# Altium schematic sheet Main_3.SchDoc
size 400 x 299 mm; SheetNumber: 6; SheetTotal: 12
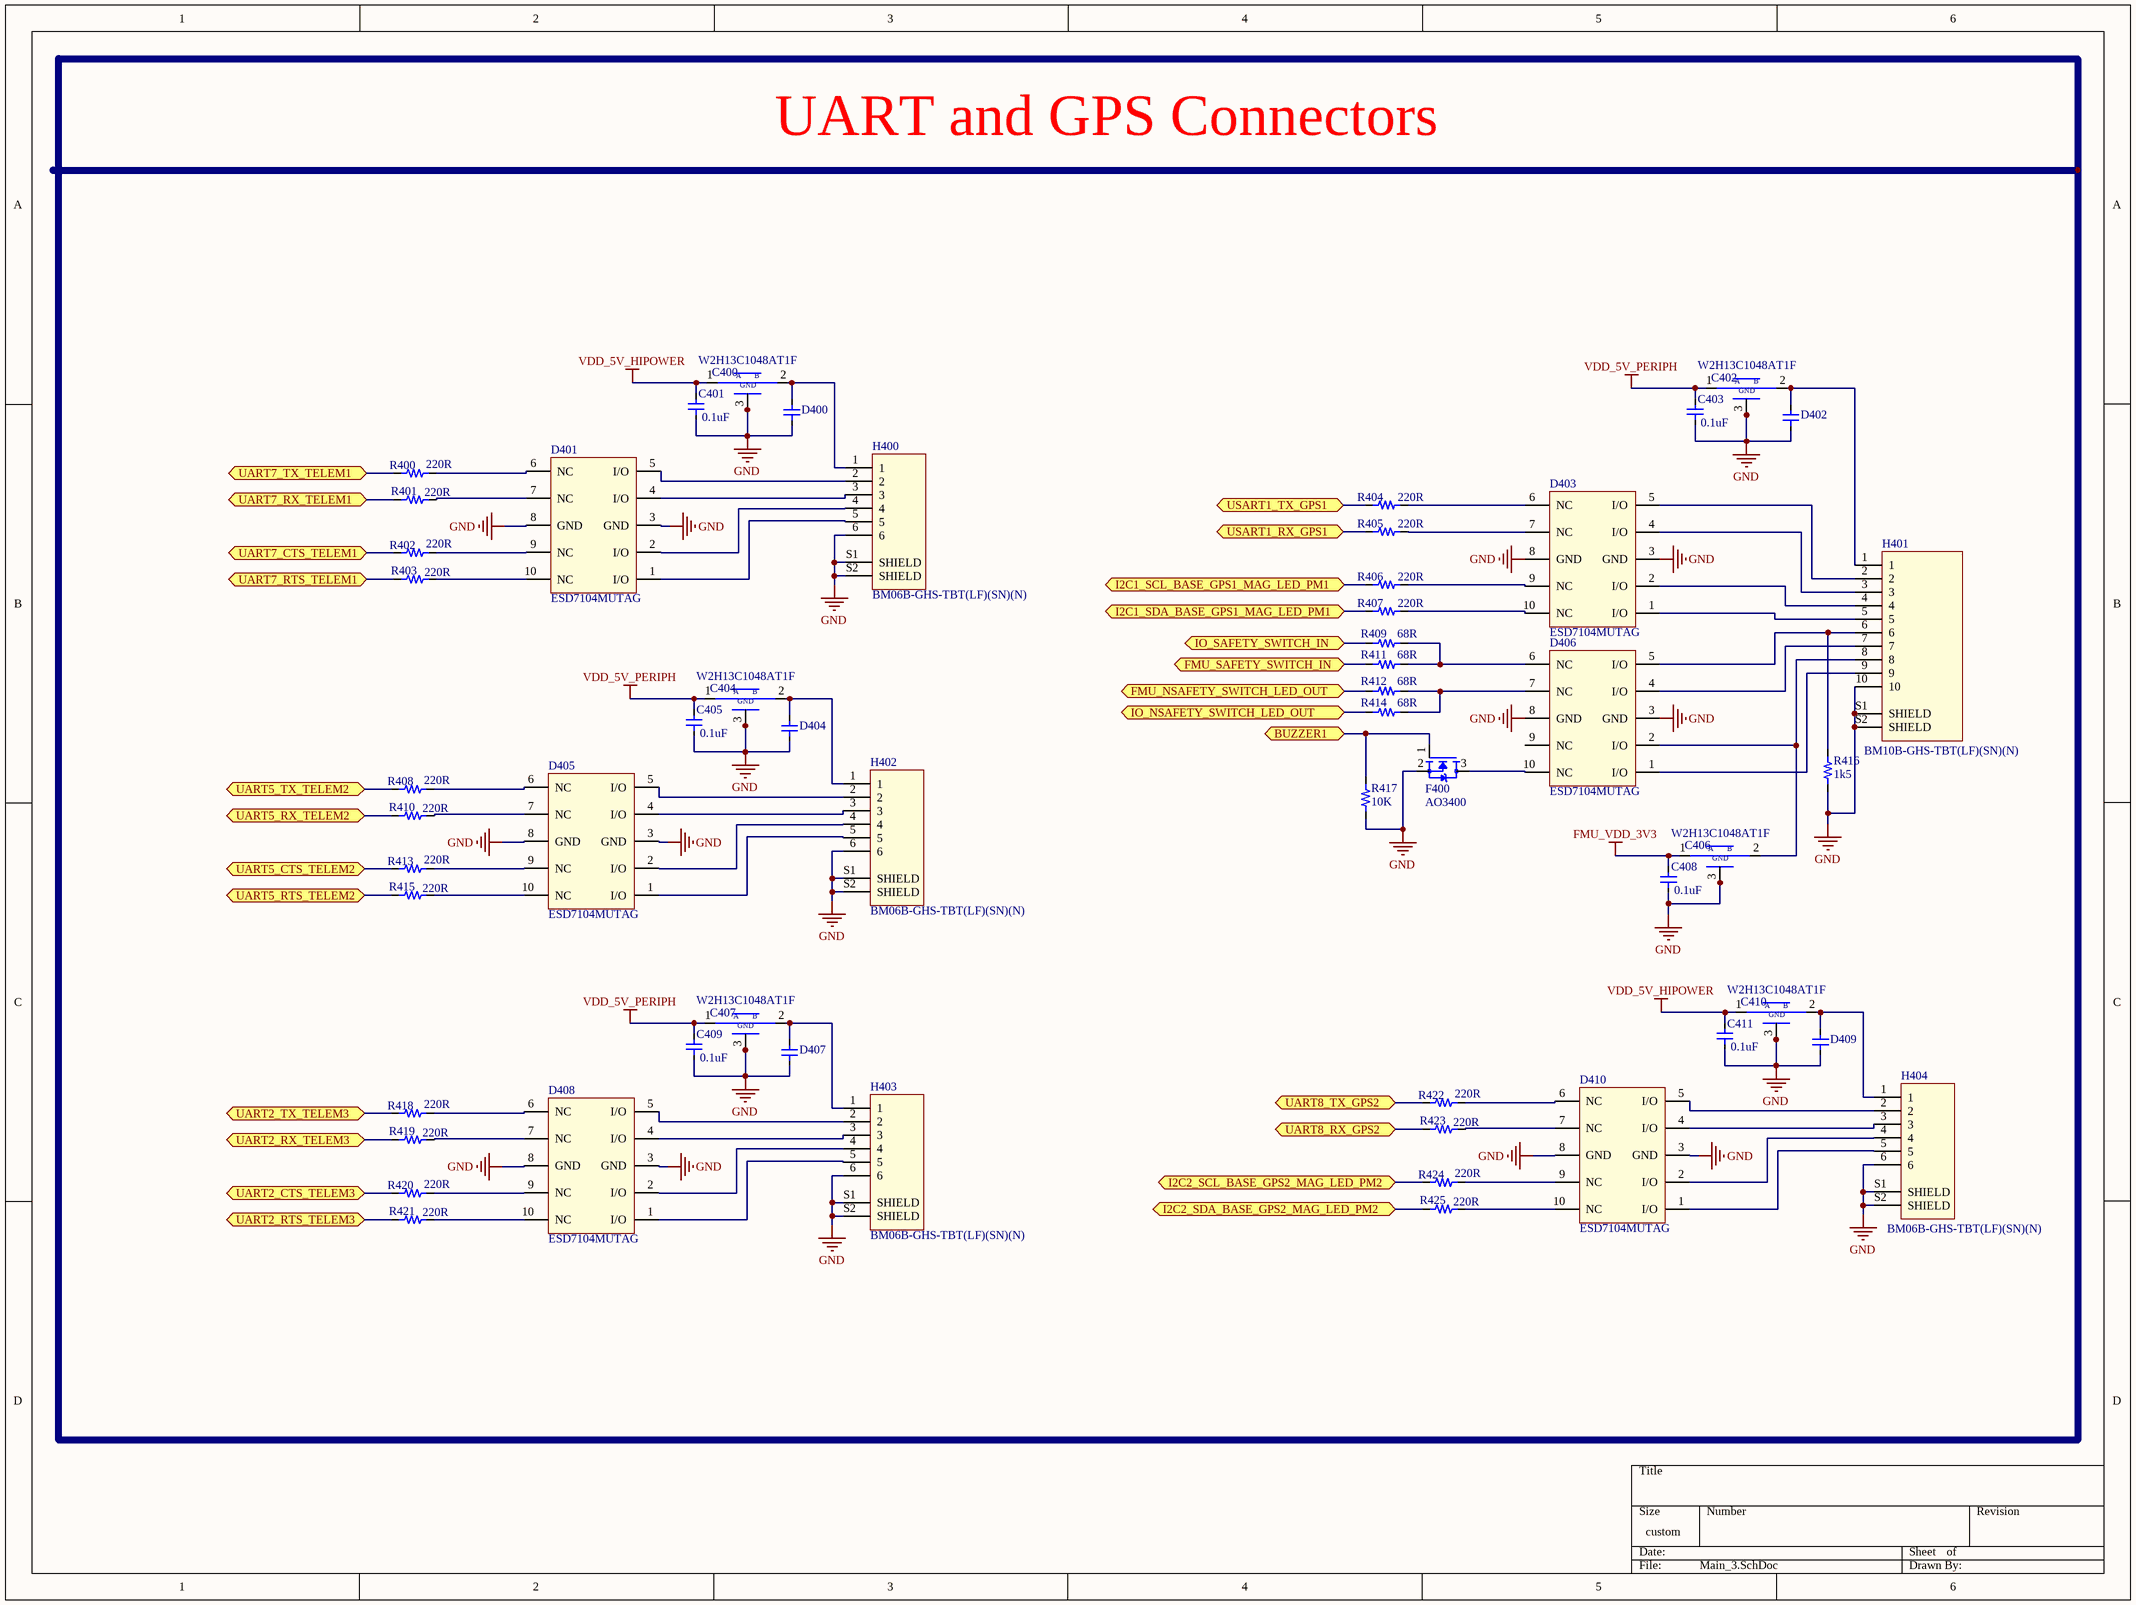
[diagram p0: Main_3.SchDoc]

## Parts
C400  W2H13C1048AT1F  [W2H13C1048AT1F]
C401  0.1uF  [C0603]
C402  W2H13C1048AT1F  [W2H13C1048AT1F]
C403  0.1uF  [C0603]
C404  W2H13C1048AT1F  [W2H13C1048AT1F]
C405  0.1uF  [C0603]
C406  W2H13C1048AT1F  [W2H13C1048AT1F]
C407  W2H13C1048AT1F  [W2H13C1048AT1F]
C408  0.1uF  [C0603]
C409  0.1uF  [C0603]
C410  W2H13C1048AT1F  [W2H13C1048AT1F]
C411  0.1uF  [C0603]
D400  PESD0402-140  [PESD0402-140]  (value not drawn)
D401  ESD7104MUTAG  [UDFN10 2.5x1, 0.5P]
D402  PESD0402-140  [PESD0402-140]  (value not drawn)
D403  ESD7104MUTAG  [UDFN10 2.5x1, 0.5P]
D404  PESD0402-140  [PESD0402-140]  (value not drawn)
D405  ESD7104MUTAG  [UDFN10 2.5x1, 0.5P]
D406  ESD7104MUTAG  [UDFN10 2.5x1, 0.5P]
D407  PESD0402-140  [PESD0402-140]  (value not drawn)
D408  ESD7104MUTAG  [UDFN10 2.5x1, 0.5P]
D409  PESD0402-140  [PESD0402-140]  (value not drawn)
D410  ESD7104MUTAG  [UDFN10 2.5x1, 0.5P]
F400  AO3400  [SOT-23]
H400  BM06B-GHS-TBT(LF)(SN)(N)  [BM06B-GHS-TBT(LF)(SN)(N)]
H401  BM10B-GHS-TBT(LF)(SN)(N)  [BM10B-GHS-TBT(LF)(SN)(N)]
H402  BM06B-GHS-TBT(LF)(SN)(N)  [BM06B-GHS-TBT(LF)(SN)(N)]
H403  BM06B-GHS-TBT(LF)(SN)(N)  [BM06B-GHS-TBT(LF)(SN)(N)]
H404  BM06B-GHS-TBT(LF)(SN)(N)  [BM06B-GHS-TBT(LF)(SN)(N)]
R400  220R  [R0402]
R401  220R  [R0402]
R402  220R  [R0402]
R403  220R  [R0402]
R404  220R  [R0402]
R405  220R  [R0402]
R406  220R  [R0402]
R407  220R  [R0402]
R408  220R  [R0402]
R409  68R  [R0402]
R410  220R  [R0402]
R411  68R  [R0402]
R412  68R  [R0402]
R413  220R  [R0402]
R414  68R  [R0402]
R415  220R  [R0402]
R416  1k5  [R0402]
R417  10K  [R0402]
R418  220R  [R0402]
R419  220R  [R0402]
R420  220R  [R0402]
R421  220R  [R0402]
R422  220R  [R0402]
R423  220R  [R0402]
R424  220R  [R0402]
R425  220R  [R0402]

## Ports
BUZZER1 (bidir), FMU_NSAFETY_SWITCH_LED_OUT (bidir), FMU_SAFETY_SWITCH_IN (bidir), I2C1_SCL_BASE_GPS1_MAG_LED_PM1 (bidir), I2C1_SDA_BASE_GPS1_MAG_LED_PM1 (bidir), I2C2_SCL_BASE_GPS2_MAG_LED_PM2 (bidir), I2C2_SDA_BASE_GPS2_MAG_LED_PM2 (bidir), IO_NSAFETY_SWITCH_LED_OUT (bidir), IO_SAFETY_SWITCH_IN (bidir), UART2_CTS_TELEM3 (bidir), UART2_RTS_TELEM3 (bidir), UART2_RX_TELEM3 (bidir), UART2_TX_TELEM3 (bidir), UART5_CTS_TELEM2 (bidir), UART5_RTS_TELEM2 (bidir), UART5_RX_TELEM2 (bidir), UART5_TX_TELEM2 (bidir), UART7_CTS_TELEM1 (bidir), UART7_RTS_TELEM1 (bidir), UART7_RX_TELEM1 (bidir), UART7_TX_TELEM1 (bidir), UART8_RX_GPS2 (bidir), UART8_TX_GPS2 (bidir), USART1_RX_GPS1 (bidir), USART1_TX_GPS1 (bidir)

## Nets
FMU_VDD_3V3: C406.1 C408.2
GND: C400.3 C400.4 C401.1 C402.3 C402.4 C403.1 C404.3 C404.4 C405.1 C406.3 C406.4 C407.3 C407.4 C408.1 C409.1 C410.3 C410.4 C411.1 D400.1 D401.3(GND) D401.8(GND) D402.1 D403.3(GND) D403.8(GND) D404.1 D405.3(GND) D405.8(GND) D406.3(GND) D406.8(GND) D407.1 D408.3(GND) D408.8(GND) D409.1 D410.3(GND) D410.8(GND) F400.2(S) H400.6 H400.S1(SHIELD) H400.S2(SHIELD) H401.10 H401.S1(SHIELD) H401.S2(SHIELD) H402.6 H402.S1(SHIELD) H402.S2(SHIELD) H403.6 H403.S1(SHIELD) H403.S2(SHIELD) H404.6 H404.S1(SHIELD) H404.S2(SHIELD) R416.1 R417.1
VDD_5V_HIPOWER: C400.1 C401.2 C410.1 C411.2
VDD_5V_PERIPH: C402.1 C403.2 C404.1 C405.2 C407.1 C409.2
BUZZER1: F400.1(G) R417.2 ; port BUZZER1
FMU_NSAFETY_SWITCH_LED_OUT: R412.1 ; port FMU_NSAFETY_SWITCH_LED_OUT
FMU_SAFETY_SWITCH_IN: R411.1 ; port FMU_SAFETY_SWITCH_IN
I2C1_SCL_BASE_GPS1_MAG_LED_PM1: R406.1 ; port I2C1_SCL_BASE_GPS1_MAG_LED_PM1
I2C1_SDA_BASE_GPS1_MAG_LED_PM1: R407.1 ; port I2C1_SDA_BASE_GPS1_MAG_LED_PM1
I2C2_SCL_BASE_GPS2_MAG_LED_PM2: R424.1 ; port I2C2_SCL_BASE_GPS2_MAG_LED_PM2
I2C2_SDA_BASE_GPS2_MAG_LED_PM2: R425.1 ; port I2C2_SDA_BASE_GPS2_MAG_LED_PM2
IO_NSAFETY_SWITCH_LED_OUT: R414.1 ; port IO_NSAFETY_SWITCH_LED_OUT
IO_SAFETY_SWITCH_IN: R409.1 ; port IO_SAFETY_SWITCH_IN
UART2_CTS_TELEM3: R420.1 ; port UART2_CTS_TELEM3
UART2_RTS_TELEM3: R421.1 ; port UART2_RTS_TELEM3
UART2_RX_TELEM3: R419.1 ; port UART2_RX_TELEM3
UART2_TX_TELEM3: R418.1 ; port UART2_TX_TELEM3
UART5_CTS_TELEM2: R413.1 ; port UART5_CTS_TELEM2
UART5_RTS_TELEM2: R415.1 ; port UART5_RTS_TELEM2
UART5_RX_TELEM2: R410.1 ; port UART5_RX_TELEM2
UART5_TX_TELEM2: R408.1 ; port UART5_TX_TELEM2
UART7_CTS_TELEM1: R402.1 ; port UART7_CTS_TELEM1
UART7_RTS_TELEM1: R403.1 ; port UART7_RTS_TELEM1
UART7_RX_TELEM1: R401.1 ; port UART7_RX_TELEM1
UART7_TX_TELEM1: R400.1 ; port UART7_TX_TELEM1
UART8_RX_GPS2: R423.1 ; port UART8_RX_GPS2
UART8_TX_GPS2: R422.1 ; port UART8_TX_GPS2
USART1_RX_GPS1: R405.1 ; port USART1_RX_GPS1
USART1_TX_GPS1: R404.1 ; port USART1_TX_GPS1
NetC400_2: C400.2 D400.2 H400.1
NetC402_2: C402.2 D402.2 H401.1
NetC404_2: C404.2 D404.2 H402.1
NetC406_2: C406.2 D406.2(I/O) H401.8
NetC407_2: C407.2 D407.2 H403.1
NetC410_2: C410.2 D409.2 H404.1
NetD401_1: D401.1(I/O) H400.5
NetD401_2: D401.2(I/O) H400.4
NetD401_4: D401.4(I/O) H400.3
NetD401_5: D401.5(I/O) H400.2
NetD401_6: D401.6(NC) R400.2
NetD401_7: D401.7(NC) R401.2
NetD401_9: D401.9(NC) R402.2
NetD401_10: D401.10(NC) R403.2
NetD403_1: D403.1(I/O) H401.5
NetD403_2: D403.2(I/O) H401.4
NetD403_4: D403.4(I/O) H401.3
NetD403_5: D403.5(I/O) H401.2
NetD403_6: D403.6(NC) R404.2
NetD403_7: D403.7(NC) R405.2
NetD403_9: D403.9(NC) R406.2
NetD403_10: D403.10(NC) R407.2
NetD405_1: D405.1(I/O) H402.5
NetD405_2: D405.2(I/O) H402.4
NetD405_4: D405.4(I/O) H402.3
NetD405_5: D405.5(I/O) H402.2
NetD405_6: D405.6(NC) R408.2
NetD405_7: D405.7(NC) R410.2
NetD405_9: D405.9(NC) R413.2
NetD405_10: D405.10(NC) R415.2
NetD406_1: D406.1(I/O) H401.9
NetD406_4: D406.4(I/O) H401.7
NetD406_5: D406.5(I/O) H401.6 R416.2
NetD406_6: D406.6(NC) R409.2 R411.2
NetD406_7: D406.7(NC) R412.2 R414.2
NetD406_10: D406.10(NC) F400.3(D)
NetD408_1: D408.1(I/O) H403.5
NetD408_2: D408.2(I/O) H403.4
NetD408_4: D408.4(I/O) H403.3
NetD408_5: D408.5(I/O) H403.2
NetD408_6: D408.6(NC) R418.2
NetD408_7: D408.7(NC) R419.2
NetD408_9: D408.9(NC) R420.2
NetD408_10: D408.10(NC) R421.2
NetD410_1: D410.1(I/O) H404.5
NetD410_2: D410.2(I/O) H404.4
NetD410_4: D410.4(I/O) H404.3
NetD410_5: D410.5(I/O) H404.2
NetD410_6: D410.6(NC) R422.2
NetD410_7: D410.7(NC) R423.2
NetD410_9: D410.9(NC) R424.2
NetD410_10: D410.10(NC) R425.2

Not connected (* = marked no-connect by the designer): D406 9(NC)

## Notes on the sheet
- UART and GPS Connectors
- (in symbol W2H13C1048AT1F) A; B; GND

## Library data of the parts
C400 C402 C404 C406 C407 C410 = W2H13C1048AT1F: Feed Through Capacitors 25V 0.1uF X7R
C401 C403 C405 C408 C409 C411 = CC0603KRX7R8BB104: CAP CER 0.1UF 25V X7R 0603
D400 D402 D404 D407 D409 = PESD0402-140: 40V Clamp - Ipp Tvs Diode Surface Mount 0402
D401 D403 D405 D406 D408 D410 = ESD7104MUTAG: TVS DIODE 5VWM 10VC 10UDFN
F400 = AO3400: N-Channel 30 V 5.8A (Ta) 1.5W (Ta) Surface Mount SOT-23
H400 H402-H404 = BM06B-GHS-TBT(LF)(SN)(N): Connector Header Surface Mount 6 position 0.049" (1.25mm)
H401 = BM10B-GHS-TBT(LF)(SN)(N): Connector Header Surface Mount 10 position 0.049" (1.25mm)
R400-R408 R410 R413 R415 R418-R425 = RC0402FR-07220RL: RES 220 OHM 1% 1/16W 0402
R409 R411 R412 R414 = RC0402FR-0768RL: 68 Ohms ±1% 0.063W, 1/16W Chip Resistor 0402 (1005 Metric) Moisture Resistant Thick Film
R416 = RC0402FR-131K5L: 1.5 kOhms ±1% 0.063W, 1/16W Chip Resistor 0402 (1005 Metric) Thick Film
R417 = RC1005F103CS: RES SMD 10K OHM 1% 1/16W 0402